# Altium schematic sheet 4-20mA.SchDoc
size A; SheetNumber: 8; SheetTotal: 15
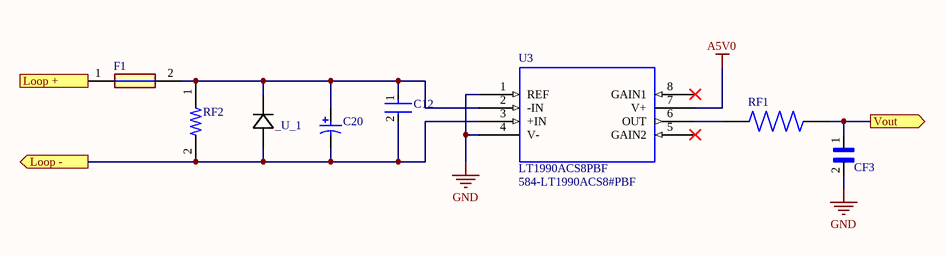
[diagram p0: 4-20mA.SchDoc]

## Parts
_U_1  1KSMB39CA  [1KSMBSeries_LTF]  (value not drawn)
C12  C0603C104K5RACTU  [FP-C0603C-CF-IPC_A]  (value not drawn)
C20  UUD1V4R7MCL1GS  [NIC-CAPA2-4X5.8_V]  (value not drawn)
CF3  GCM188R71C105KA64J  [CAPC1608X90N]  (value not drawn)
F1  0ZCJ0005FF2E  [FUSC3216X85N]  (value not drawn)
RF1  CRS2010AFX-1001ELF  [RESC5025X70N]  (value not drawn)
RF2  CRGS0805J100R  [RESC2012X65N]  (value not drawn)
U3  LT1990ACS8PBF  Supplier Part Number 1: 584-LT1990ACS8#PBF  [SO-8_S]

## Ports
Loop + (in), Loop - (out), Vout (out)

## Nets
A5V0: U3.7(V+)
GND: CF3.2 U3.1(REF) U3.4(V-)
Loop +: F1.1 ; port Loop +
Loop -: _U_1.2 C12.2 C20.2 RF2.2 U3.3(+IN) ; port Loop -
Vout: CF3.1 RF1.2 ; port Vout
Net_U_1_1: _U_1.1 C12.1 C20.1 F1.2 RF2.1 U3.2(-IN)
NetRF1_1: RF1.1 U3.6(OUT)

Not connected (* = marked no-connect by the designer): U3 5(GAIN2)* 8(GAIN1)*

## Library data of the parts
_U_1 = 1KSMB39CA: No Description Available; Mfr_Name: Littelfuse Inc; Copyright: Copyright (C) 2021 Ultra Librarian. All rights reserved.; Manufacturer_Part_Number: 1KSMB39CA; Digi-Key_Part_Number_1: 1KSMB39CA-ND; Digi-Key_Part_Number_2: F11451CT-ND; Digi-Key_Part_Number_3: F11451DKR-ND; Digi-Key_Part_Number_4: F11451TR-ND; RefDes: RefDes; Type: DEV; Supplier 1: Digi-Key; Supplier Part Number 1: F11451CT-ND
C12 = C0603C104K5RACTU: Multilayer Ceramic Capacitors (MLCC) - SMD/SMT 50volts 0.1uF X7R 10%; Manufacturer: KEMET; Voltage Rating (DC): 50V; Capacitance: 100nF; Dissipation Factor: 2.5%; Supplier 1: Digi-Key; Manufacturer Part Number: C0603C104K5RACTU; RoHS: Yes; Category: Ceramic Capacitors; Pricing 1: 1=0.12000, 10=0.08500, 50=0.04620, 100=0.03770, 500=0.02696, 1000=0.02118 (USD); Mount: Surface Mount; Case/Package: 0603; Number of Pins: 2; Case Code (Metric): 1608; Case Code (Imperial): 0603; Dielectric Material: Ceramic; Contact Plating: Tin,Matte; Min Operating Temperature: -55°C; Max Operating Temperature: 125°C; Tolerance: 10%; Voltage Rating: 50V; Packaging: Tape and Reel; Package Quantity: 1; Dielectric: X7R; Termination: SMD/SMT; Voltage: 50V; Series: SMD Comm X7R; Length: 0.063inch; Width: 0.031inch; Height: 0.8mm; Thickness: 0.034inch; Depth: 0.8mm; Lead Pitch: 0.7mm; Radiation Hardening: No; REACH SVHC: No SVHC; RoHS Compliant: Yes; ComponentLink1URL: https://datasheet.ciiva.com/7823/kem-c1002-x7r-smd-7823591.pdf?src-supplier=Element14; ComponentLink1Description: https://datasheet.ciiva.com/7823/kem-c1002-x7r-smd-7823591.pdf?src-supplier=Element14; ComponentLink2URL: https://datasheet.ciiva.com/7823/kem-c1002-x7r-smd-7823592.pdf?src-supplier=Element14; ComponentLink2Description: https://datasheet.ciiva.com/7823/kem-c1002-x7r-smd-7823592.pdf?src-supplier=Element14; ComponentLink3URL: https://datasheet.ciiva.com/5999/kem-c1002-x7r-smd-5999400.pdf?src-supplier=Farnell; ComponentLink3Description: https://datasheet.ciiva.com/5999/kem-c1002-x7r-smd-5999400.pdf?src-supplier=Farnell; ComponentLink4URL: https://datasheet.ciiva.com/28645/1851736-28645640.pdf?src-supplier=Element14; ComponentLink4Description: https://datasheet.ciiva.com/28645/1851736-28645640.pdf?src-supplier=Element14; ComponentLink5URL: https://datasheet.ciiva.com/14585/70095383-14585209.pdf?src-supplier=Allied+Electronics; ComponentLink5Description: https://datasheet.ciiva.com/14585/70095383-14585209.pdf?src-supplier=Allied+Electronics; ComponentLink6URL: https://datasheet.ciiva.com/14602/70095383-14602583.pdf?src-supplier=Allied+Electronics; ComponentLink6Description: https://datasheet.ciiva.com/14602/70095383-14602583.pdf?src-supplier=Allied+Electronics; Supplier Part Number 1: 399-C0603C104K5RAC7867CT-ND; Stock 1: 10133409
C20 = UUD1V4R7MCL1GS: Cap Aluminum Lytic 4.7uF 35V 20% (4 X 5.8mm) SMD 80mA 2000h 105C Automotive T/R; Manufacturer: Nichicon; Dielectric Material: Aluminium; Leakage Current: 3uA; Life (Hours): 2000Hour; Impedance: 1.8R; Dissipation Factor: 0.12%; Supplier 1: Digi-Key; Manufacturer Part Number: UUD1V4R7MCL1GS; RoHS: Yes; Category: Aluminum Electrolytic Capacitors; Pricing 1: 1=0.51000, 10=0.35600, 50=0.24960, 100=0.21390, 500=0.16042, 1000=0.13547 (USD); Case/Package: Radial; Number of Pins: 2; Min Operating Temperature: -55°C; Max Operating Temperature: 105°C; Tolerance: 20%; Ripple Current: 80mA; Package Quantity: 2000; Voltage Rating (DC): 35V; Packaging: Tape and Reel; Capacitance: 4.7uF; Termination: SMD/SMT; Series: UUD; Voltage Rating: 35V; Construction: Cylindrical; Ripple Current (AC): 80mA; Diameter: 4mm; Length: 5.8mm; Height: 5.8mm; Height - Seated (Max): 0.228inch; Radiation Hardening: No; RoHS Compliant: Yes; Lead Free: Lead Free; REACH SVHC: No SVHC; ComponentLink1URL: https://datasheet.ciiva.com/96/e-ud-96647.pdf?src-supplier=Digi-Key; ComponentLink1Description: https://datasheet.ciiva.com/96/e-ud-96647.pdf?src-supplier=Digi-Key; ComponentLink2URL: https://datasheet.ciiva.com/96/e-ud-96648.pdf?src-supplier=Digi-Key; ComponentLink2Description: https://datasheet.ciiva.com/96/e-ud-96648.pdf?src-supplier=Digi-Key; ComponentLink3URL: https://datasheet.ciiva.com/96/e-ud-96649.pdf?src-supplier=Digi-Key; ComponentLink3Description: https://datasheet.ciiva.com/96/e-ud-96649.pdf?src-supplier=Digi-Key; ComponentLink4URL: https://datasheet.ciiva.com/5360/e-ud-5360520.pdf?src-supplier=Mouser; ComponentLink4Description: https://datasheet.ciiva.com/5360/e-ud-5360520.pdf?src-supplier=Mouser; ComponentLink5URL: https://datasheet.ciiva.com/11687/e-ud-11687388.pdf?src-supplier=Avnet; ComponentLink5Description: https://datasheet.ciiva.com/11687/e-ud-11687388.pdf?src-supplier=Avnet; ComponentLink6URL: https://datasheet.ciiva.com/16383/e-ud-16383407.pdf?src-supplier=Future+Electronics; ComponentLink6Description: https://datasheet.ciiva.com/16383/e-ud-16383407.pdf?src-supplier=Future+Electronics; ComponentLink7URL: https://datasheet.ciiva.com/7793/e-ud-7793429.pdf?src-supplier=Element14; ComponentLink7Description: https://datasheet.ciiva.com/7793/e-ud-7793429.pdf?src-supplier=Element14; ComponentLink8URL: https://datasheet.ciiva.com/17354/e-ud-17354680.pdf?src-supplier=Avnet+Europe; ComponentLink8Description: https://datasheet.ciiva.com/17354/e-ud-17354680.pdf?src-supplier=Avnet+Europe; Supplier Part Number 1: 493-2281-1-ND; Stock 1: 5341
CF3 = GCM188R71C105KA64J: 0603 1 uF 16 V Â±10% Tolerance X7R Automotive Multilayer Ceramic Capacitor; MF: Murata; Value: *; Price: None; Package: 1608 Murata; Check_prices: https://www.snapeda.com/parts/GCM188R71C105KA64J/Murata%20Electronics%20North%20America/view-part/1755583/?ref=eda; Availability: In Stock; SnapEDA_Link: https://www.snapeda.com/parts/GCM188R71C105KA64J/Murata%20Electronics%20North%20America/view-part/1755583/?ref=snap; MP: GCM188R71C105KA64J; Supplier 1: Mouser; Supplier Part Number 1: 81-GCM188R71C105KA4J
F1 = 0ZCJ0005FF2E: Fuse; Manufacturer_Name: Bel Circuit Protection; Datasheet Link: https://www.belfuse.com/resources/datasheets/circuitprotection/ds-cp-0zcj-series.pdf; Height: 0.85mm; Manufacturer_Part_Number: 0ZCJ0005FF2E; Arrow Part Number: 0ZCJ0005FF2E; Arrow Price/Stock: https://www.arrow.com/en/products/0zcj0005ff2e/bel-group
RF2 = CRGS0805J100R: 100 Ohms Â±5% 0.5W, 1/2W Chip Resistor 0805 _2012 Metric_ Pulse Withstanding Thick Film; MF: TE Connectivity; TE_purchase_URL: https://www.te.com/usa-en/product-2-2176244-5.html?te_bu=Cor&te_type=disp&te_campaign=seda_glo_cor-seda-global-disp-prtnr-fy19-seda-model-bom-cta_sma-317_1&elqCampaignId=32493; Package: 0805 TE Connectivity; SnapEDA_Link: https://www.snapeda.com/parts/CRGS0805J100R/TE%20Connectivity%20AMP%20Connectors/view-part/1008227/?ref=snap; MP: CRGS0805J100R; Value: *; Availability: Unavailable; Price: None; Supplier 1: Mouser; Supplier Part Number 1: 279-CRGS0805J100R
U3 = LT1990ACS8PBF: SP Amp DIFF AMP Single R-R O/P ±18V/36V Automotive 8-Pin SOIC N Tube; Manufacturer: Analog Devices / Linear Technology; MF: Analog Devices; MP: LT1990ACS8#PBF; Bandwidth: 100kHz; Number of Channels: 1; Common Mode Rejection Ratio: 70dB; Min Dual Supply Voltage: 1.35V; Max Dual Supply Voltage: 18V; -3db Bandwidth: 105kHz; Slew Rate: 0.55V/µs; Max Supply Voltage: 36V; Min Supply Voltage: 2.4V; Input Offset Voltage (Vos): 5.2mV; Operating Supply Current: 140uA; Output Current per Channel: 22mA; Power Supply Rejection Ratio (PSRR): 80dB; Input Resistance: 2MR; Amplifier Type: DIFFERENTIAL; Price: None; Availability: Good; SnapEDA_Link: https://www.snapeda.com/parts/LT1990ACS8%23PBF/Analog%20Devices/view-part/4348994/?ref=snap; Package: SOIC -8 Analog Devices; Value: *; Purchase-URL: https://pricing.snapeda.com/search/part/LT1990ACS8#PBF/?ref=eda; Supplier 1: Mouser; Check_prices: h; Manufacturer Part Number: LT1990ACS8#PBF; RoHS: Yes; Category: Amplifiers - Op Amps, Buffer, Instrumentation; Stock 1: 55; Pricing 1: 1=5.20000, 10=4.67000, 50=4.42000, 100=3.82000, 1000=3.25000, 10000=3.25000 (USD); Case/Package: SOIC; Number of Pins: 8; Min Operating Temperature: 0°C; Max Operating Temperature: 70°C; Package Quantity: 100; Packaging: Rail/Tube; Nominal Gain Bandwidth Product: 100kHz; Number of Circuits: 1; Number of Amplifiers: 1; Number of Elements: 1; Radiation Hardening: No; REACH SVHC: No SVHC; Lead Free: Lead Free; RoHS Compliant: Yes; ComponentLink1URL: https://datasheet.ciiva.com/15128/getdatasheetpartid-371446-15128871.pdf?src-supplier=Verical; ComponentLink1Description: https://datasheet.ciiva.com/15128/getdatasheetpartid-371446-15128871.pdf?src-supplier=Verical; ComponentLink2URL: https://datasheet.ciiva.com/1802/5087-1802941.pdf?src-supplier=Digi-Key; ComponentLink2Description: https://datasheet.ciiva.com/1802/5087-1802941.pdf?src-supplier=Digi-Key; ComponentLink3URL: https://datasheet.ciiva.com/1492/1990fb-1492770.pdf?src-supplier=Farnell; ComponentLink3Description: https://datasheet.ciiva.com/1492/1990fb-1492770.pdf?src-supplier=Farnell; ComponentLink4URL: https://datasheet.ciiva.com/1485/1679607-1485298.pdf?src-supplier=Element14; ComponentLink4Description: https://datasheet.ciiva.com/1485/1679607-1485298.pdf?src-supplier=Element14
RF1 = CRS2010AFX-1001ELF: Package: None; Price: None; Value: *; MP: CRS2010AFX-1001ELF; Availability: Unavailable; Supplier 1: Digi-Key; Supplier Part Number 1: CRS2010AFX-1001ELFCT-ND